# Altium schematic sheet Steering Wheel.SchDoc (part 2 of 2)
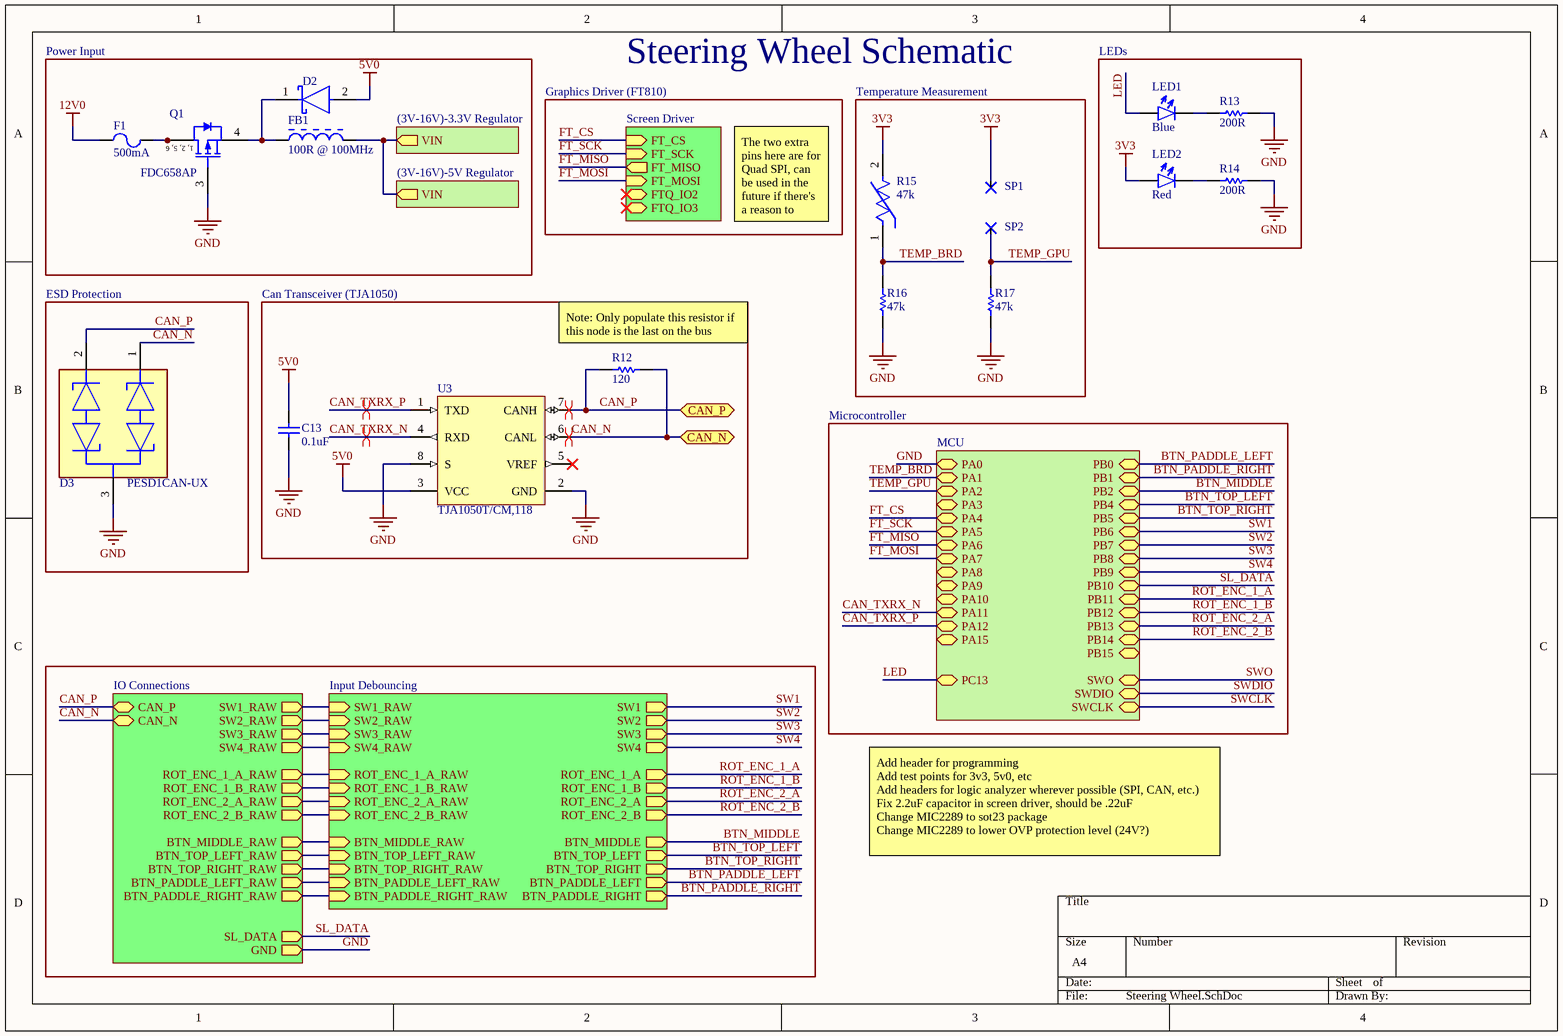
[diagram p1: Steering Wheel.SchDoc]

## Library data of the parts
C13 = CMP-2007-00279-1: Part Number: C0805C104K5RACTU; Manufacturer: Kemet; Dielectric Material: Ceramic; Capacitance: 100nF; Tolerance: 10%; Voltage Rating: 50V; Dielectric: X7R; Voltage: 500V; Supplier 1: LCSC; Supplier Part Number 1: C129690; Manufacturer Part Number: C0805C104K5RACTU; RoHS: Yes; Category: Ceramic Capacitors; Stock 1: 744050; Pricing 1: 50=0.02360, 500=0.01780, 1500=0.01680, 5000=0.01570, 25000=0.01530, 50000=0.01500, 50=0.02250, 500=0.01700, 1500=0.01600, 5000=0.01500, 25000=0.01460, 50000=0.01430, 50=0.11760, 500=0.08890, 1500=0.08370, 5000=0.07840, 25000=0.07610, 50000=0.07490, 50=0.10700, 500=0.08090, 1500=0.07610, 5000=0.07130, 25000=0.06920, 50000=0.06810, 50=0.01440, 500=0.01090, 1500=0.01020, 5000=0.00960, 25000=0.00930, 50000=0.00920, 50=0.01310, 500=0.00990, 1500=0.00930, 5000=0.00870, 25000=0.00850, 50000=0.00830, 50=0.13020, 500=0.09850, 1500=0.09270, 5000=0.08680, 25000=0.08420, 50000=0.08300, 50=1.77600, 500=1.34310, 1500=1.26360, 5000=1.18400, 25000=1.14870, 50000=1.13130, 50=0.07150, 500=0.05410, 1500=0.05090, 5000=0.04770, 25000=0.04620, 50000=0.04550, 50=1.20420, 500=0.91060, 1500=0.85670, 5000=0.80280, 25000=0.77880, 50000=0.76700, 50=0.14790, 500=0.11180, 1500=0.10520, 5000=0.09860, 25000=0.09570, 50000=0.09420, 50=0.02320, 500=0.01750, 1500=0.01650, 5000=0.01550, 25000=0.01500, 50000=0.01480, 50=0.01680, 500=0.01271, 1500=0.01196, 5000=0.01120, 25000=0.01087, 50000=0.01070 (AUD); Mount: Surface Mount,PCB; Case/Package: 0805; Number of Pins: 2; Case Code (Imperial): 0805; Case Code (Metric): 2012; Contact Plating: Tin,Matte; Min Operating Temperature: -55°C; Max Operating Temperature: 125°C; Packaging: Tape and Reel; Termination: SMD/SMT; Package Quantity: 4000; Voltage Rating (DC): 50V; Length: 2mm; Height: 0.9mm; Depth: 1.25mm; Width: 1.2mm; Thickness: 0.035inch; Lead Pitch: 0.75mm; Radiation Hardening: No; REACH SVHC: No SVHC; ComponentLink1URL: https://datasheet.ciiva.com/14589/70095383-14589048.pdf?src-supplier=Allied+Electronics; ComponentLink1Description: https://datasheet.ciiva.com/14589/70095383-14589048.pdf?src-supplier=Allied+Electronics; ComponentLink2URL: https://datasheet.ciiva.com/28682/1851736-28682232.pdf?src-supplier=Element14; ComponentLink2Description: https://datasheet.ciiva.com/28682/1851736-28682232.pdf?src-supplier=Element14; ComponentLink3URL: https://datasheet.ciiva.com/32431/slceramic-chip-condensers-e-32431755.pdf?src-supplier=Distrelec; ComponentLink3Description: https://datasheet.ciiva.com/32431/slceramic-chip-condensers-e-32431755.pdf?src-supplier=Distrelec; ComponentLink4URL: https://datasheet.ciiva.com/18410/70095383-18410815.pdf?src-supplier=Allied+Electronics; ComponentLink4Description: https://datasheet.ciiva.com/18410/70095383-18410815.pdf?src-supplier=Allied+Electronics; Supplier 2: Digi-Key; Supplier Part Number 2: 399-1170-1-ND; Stock 2: 2736847; Pricing 2: 1=0.16000, 10=0.11500, 50=0.06540, 100=0.05420, 500=0.03802, 1000=0.03147 (USD)
D2 = CMP-02539-000022-1: DIODE SCHOTTKY 40V 3A DO214AC; Manufacturer Part Number: SSA34-E3/61T; Manufacturer: Vishay; Standoff Height: 0mm; Peak Reverse Current: 0.2mA; Max Surge Forward Current: 75A; Max Junction Temp: +150°C; Forward Voltage: 490mV; Element Configuration: Single; Max Reverse Current: 200uA; Polarity: Standard; Mouser Description: Schottky Diodes & Rectifiers 3.0 Amp 40 Volt; Package: 95400; Octopart: https://octopart.com/ssa34-e3%2F61t-vishay-39552934; Reverse Voltage: 40V; Height: 2.29mm; Max Repetitive Reverse Voltage: 40V; Device Class L2: Diodes; Forward Current: 3A; Device Class L1: Discrete Semiconductors; Temperature Range High: +150°C; Automotive: No; ComponentLink2URL: http://www.vishay.com/docs/88883/ssa33l.pdf; Footprint Url: https://www.vishay.com/docs/95400/sma.pdf; ComponentLink2Description: Datasheet; RoHS: TRUE; Temperature Range Low: -65°C; Temperature: -65°C to +150°C; Device Class L3: Schottky Diodes; Lead Free: Yes; Digikey Description: DIODE SCHOTTKY 40V 3A DO214AC; Category: Diode; Supplier 1: LCSC; Supplier Part Number 1: C466998; Stock 1: 1522; Pricing 1: 1=0.19720, 10=0.14690, 30=0.13770, 100=0.12850, 500=0.12440, 1000=0.12230, 1=0.18560, 10=0.13830, 30=0.12950, 100=0.12090, 500=0.11700, 1000=0.11510, 1=0.94580, 10=0.70470, 30=0.66030, 100=0.61610, 500=0.59640, 1000=0.58660, 1=0.88710, 10=0.66100, 30=0.61940, 100=0.57790, 500=0.55940, 1000=0.55020, 1=0.11920, 10=0.08880, 30=0.08320, 100=0.07760, 500=0.07510, 1000=0.07390, 1=0.10870, 10=0.08100, 30=0.07590, 100=0.07080, 500=0.06860, 1000=0.06750, 1=1.07410, 10=0.80030, 30=0.74990, 100=0.69970, 500=0.67730, 1000=0.66620, 1=14.63490, 10=10.90410, 30=10.21770, 100=9.53310, 500=9.22870, 1000=9.07730, 1=0.57820, 10=0.43080, 30=0.40370, 100=0.37660, 500=0.36460, 1000=0.35860, 1=10.83120, 10=8.07000, 30=7.56210, 100=7.05530, 500=6.83010, 1000=6.71810, 1=1.26610, 10=0.94330, 30=0.88390, 100=0.82470, 500=0.79840, 1000=0.78530, 1=0.19100, 10=0.14230, 30=0.13340, 100=0.12440, 500=0.12050, 1000=0.11850, 1=0.13860, 10=0.10327, 30=0.09677, 100=0.09028, 500=0.08740, 1000=0.08597 (AUD); Mount: Surface Mount; Case/Package: SMA; Number of Pins: 2; Contact Plating: Tin,Matte; Min Operating Temperature: -65°C; Max Operating Temperature: 150°C; Packaging: Tape and Reel; Average Rectified Current: 3A; Max Repetitive Reverse Voltage (Vrrm): 40V; Max Reverse Voltage (DC): 40V; Package Quantity: 1; Max Forward Surge Current (Ifsm): 75A; Peak Non-Repetitive Surge Current: 75A; Max Surge Current: 75A; Max Reverse Leakage Current: 200uA; Voltage Rating (DC): 40V; Current Rating: 3A; Output Current: 3A; Length: 4.5mm; Width: 2.79mm; Radiation Hardening: No; REACH SVHC: Unknown; ComponentLink1URL: https://datasheet.ciiva.com/26912/getdatasheetpartid-73599-26912721.pdf?src-supplier=Verical; ComponentLink1Description: https://datasheet.ciiva.com/26912/getdatasheetpartid-73599-26912721.pdf?src-supplier=Verical; ComponentLink3URL: https://datasheet.ciiva.com/23793/1761274-23793348.pdf?src-supplier=Newark; ComponentLink3Description: https://datasheet.ciiva.com/23793/1761274-23793348.pdf?src-supplier=Newark; ComponentLink4URL: https://datasheet.ciiva.com/18434/70217332-18434231.pdf?src-supplier=Allied+Electronics; ComponentLink4Description: https://datasheet.ciiva.com/18434/70217332-18434231.pdf?src-supplier=Allied+Electronics; ComponentLink5URL: https://datasheet.ciiva.com/26295/1697108-26295418.pdf?src-supplier=Element14; ComponentLink5Description: https://datasheet.ciiva.com/26295/1697108-26295418.pdf?src-supplier=Element14; ComponentLink6URL: https://datasheet.ciiva.com/16456/ssa33l-16456157.pdf?src-supplier=Future+Electronics; ComponentLink6Description: https://datasheet.ciiva.com/16456/ssa33l-16456157.pdf?src-supplier=Future+Electronics; Supplier 2: Digi-Key; Supplier Part Number 2: SSA34-E3/61TGICT-ND; Stock 2: 18229; Pricing 2: 1=0.51000, 10=0.37800, 100=0.26400, 500=0.16720 (USD)
D3 = CMP-14436-000006-1: TVS DIODE 24V 50V SC70-3; Manufacturer: Nexperia; Supplier Part Number 1: C152727; Supplier 1: LCSC; Supplier 2: Digi-Key; Supplier Part Number 2: 1727-1306-1-ND; Manufacturer Part Number: PESD1CAN-UX; RoHS: No; Category: ESD and Circuit Protection ICs; Stock 2: 174859; Pricing 2: 1=0.38000, 10=0.25600, 100=0.15110, 500=0.10230, 1000=0.08138 (USD); ComponentLink1URL: https://www.mouser.com/ds/2/302/PESD1CAN-U-1151714.pdf?src-supplier=Mouser; ComponentLink1Description: https://www.mouser.com/ds/2/302/PESD1CAN-U-1151714.pdf?src-supplier=Mouser; ComponentLink2URL: http://www.farnell.com/datasheets/1738911.pdf?src-supplier=Farnell; ComponentLink2Description: http://www.farnell.com/datasheets/1738911.pdf?src-supplier=Farnell; ComponentLink3URL: http://www.farnell.com/datasheets/1738911.pdf?src-supplier=Newark; ComponentLink3Description: http://www.farnell.com/datasheets/1738911.pdf?src-supplier=Newark; ComponentLink4URL: https://assets.nexperia.com/documents/data-sheet/PESD1CAN-U.pdf?src-supplier=Digi-Key; ComponentLink4Description: https://assets.nexperia.com/documents/data-sheet/PESD1CAN-U.pdf?src-supplier=Digi-Key; ComponentLink5URL: http://www.farnell.com/datasheets/1738911.pdf?src-supplier=Element14; ComponentLink5Description: http://www.farnell.com/datasheets/1738911.pdf?src-supplier=Element14
F1 = CMP-2000-05698-1: NANO2(R) Slo-Blo(R) Fuse, 0.5 A, 125 V, -55 to 125 degC, 2-Pin SMD, RoHS, Tape and Reel; Manufacturer: Littelfuse; Manufacturer Part Number: 0452.500MRL; Current Rating: 0.5A; Working Voltage-Max: 125V; Body Material: Ceramic; Fuse Type: Board Mount (Cartridge Style Excluded); DC Cold Resistance: 700mR; Approvals: CSA,UR,UL; Manufacturer URL: http://www.littelfuse.com/; Operating Temp Range: -55to+125°C; Package Reference: 0452; Mounting Technology: SurfaceMount; Datasheet Version: 07/2015; Response Characteristic: Slo-Blo; Datasheet URL: http://download.siliconexpert.com/pdfs/2015/7/2/10/39/10/885/ltf_/manual/4322647674859060843226474844920160littelfuse_fuse_452_454_datasheet.pdf.pdf.pdf; Size: 6.10x2.69mm; Package Description: 2-Pin Surface Mount Device, Body 6.1 x 2.69 mm; Supplier 1: LCSC; Supplier Part Number 1: C151120; RoHS: Yes; Category: Fuses; Stock 1: 2796; Pricing 1: 1=0.31300, 10=0.23510, 30=0.22080, 100=0.20640, 500=0.20010, 1000=0.19690, 1=0.29850, 10=0.22420, 30=0.21050, 100=0.19690, 500=0.19080, 1000=0.18780, 1=1.52260, 10=1.14360, 30=1.07400, 100=1.00440, 500=0.97340, 1000=0.95810, 1=1.42430, 10=1.06970, 30=1.00460, 100=0.93950, 500=0.91050, 1000=0.89620, 1=0.19140, 10=0.14370, 30=0.13500, 100=0.12620, 500=0.12230, 1000=0.12040, 1=0.17340, 10=0.13020, 30=0.12230, 100=0.11440, 500=0.11080, 1000=0.10910, 1=1.73770, 10=1.30510, 30=1.22570, 100=1.14620, 500=1.11080, 1000=1.09340, 1=23.61790, 10=17.73840, 30=16.65870, 100=15.57910, 500=15.09800, 1000=14.86100, 1=0.93380, 10=0.70130, 30=0.65860, 100=0.61590, 500=0.59690, 1000=0.58750, 1=17.53210, 10=13.16760, 30=12.36620, 100=11.56470, 500=11.20760, 1000=11.03160, 1=2.00280, 10=1.50420, 30=1.41260, 100=1.32110, 500=1.28030, 1000=1.26020, 1=0.30580, 10=0.22970, 30=0.21570, 100=0.20170, 500=0.19550, 1000=0.19240, 1=0.22422, 10=0.16840, 30=0.15815, 100=0.14790, 500=0.14333, 1000=0.14108 (AUD); Mount: Surface Mount; Case/Package: SMD/SMT; Number of Pins: 2; Terminal Material: Gold; Housing Material: Ceramic; Contact Plating: Gold; Min Operating Temperature: -55°C; Max Operating Temperature: 125°C; Packaging: Tape and Reel; Voltage Rating: 125V; Package Quantity: 1000; Voltage Rating (DC): 125V; Fuse Current: 500mA; Voltage Rating (AC): 125V; Termination: SMD/SMT; Resistance: 700mR; Working Voltage: 125V; Diameter: 2.69mm; Length: 6.1mm; Height: 2.69mm; Width: 2.69mm; Depth: 2.69mm; Radiation Hardening: No; REACH SVHC: No SVHC; Lead Free: Lead Free; ComponentLink1URL: https://datasheet.ciiva.com/299/littelfuse-fuse-452-454-series-299910.pdf?src-supplier=Digi-Key; ComponentLink1Description: https://datasheet.ciiva.com/299/littelfuse-fuse-452-454-series-299910.pdf?src-supplier=Digi-Key; ComponentLink2URL: https://datasheet.ciiva.com/15187/getdatasheetpartid-110524-15187078.pdf?src-supplier=Verical; ComponentLink2Description: https://datasheet.ciiva.com/15187/getdatasheetpartid-110524-15187078.pdf?src-supplier=Verical; ComponentLink3URL: https://datasheet.ciiva.com/299/littelfuse-fuse-452-454-series-299911.pdf?src-supplier=Digi-Key; ComponentLink3Description: https://datasheet.ciiva.com/299/littelfuse-fuse-452-454-series-299911.pdf?src-supplier=Digi-Key; ComponentLink4URL: https://datasheet.ciiva.com/299/littelfuse-fuse-452-454-series-299912.pdf?src-supplier=Digi-Key; ComponentLink4Description: https://datasheet.ciiva.com/299/littelfuse-fuse-452-454-series-299912.pdf?src-supplier=Digi-Key; ComponentLink5URL: https://datasheet.ciiva.com/46406/1788342-46406140.pdf?src-supplier=Element14; ComponentLink5Description: https://datasheet.ciiva.com/46406/1788342-46406140.pdf?src-supplier=Element14; Supplier 2: Digi-Key; Supplier Part Number 2: F2598CT-ND; Stock 2: 8127; Pricing 2: 1=1.59000, 5=1.51600, 10=1.44100, 50=1.16280, 100=0.98590, 250=0.96064, 500=0.80896 (USD)
FB1 = CMP-0686-00557-6: Chip Ferrite Bead for Power Lines, 120 Ohm, 2000 mA, -55 to 125 degC, 1.6 x 0.8 x 0.95 mm SMD, Tape and Reel; PartNumber: BLM18PG121SN1D; Manufacturer: Murata; Impedance (at 100 MHz): 120 Ohm +/- 25%; Rated Current: 2000 mA; DC Resistance: 0.05 Ohm Max.; Material: Steel,Ferrite; Impedance: 120R; Current Rating: 2A; DC Resistance (DCR): 50mR; Number of Lines: 1; Tolerance: 25%; Shielding: Unshielded; DatasheetVersion: 08/2013; PackageDescription: 2-Pin Chip, Body 1.6 x 0.8 mm; ComponentLink3URL: http://www.murata.com/products/catalog/pdf/c31e.pdf; ComponentLink1URL: http://www.murata.com/; ComponentLink2Description: Datasheet; Mounting Technology: Surface Mount; ComponentLink1Description: Manufacturer URL; PackageReference: BLM18_H950-2; ComponentLink2URL: http://www.murata.com/products/catalog/pdf/c31e.pdf; ComponentLink3Description: Package Specification; Packing: Tape and Reel; Operating Temperature Range: -55 to 125 degC; Supplier 1: LCSC; Supplier Part Number 1: C14709; Manufacturer Part Number: BLM18PG121SN1D; RoHS: Yes; Category: Inductors; Stock 1: 101650; Pricing 1: 50=0.01390, 500=0.01020, 1500=0.00950, 5000=0.00880, 25000=0.00850, 50000=0.00840, 50=0.01320, 500=0.00970, 1500=0.00910, 5000=0.00840, 25000=0.00810, 50000=0.00800, 50=0.06740, 500=0.04940, 1500=0.04610, 5000=0.04280, 25000=0.04130, 50000=0.04060, 50=0.06270, 500=0.04600, 1500=0.04290, 5000=0.03980, 25000=0.03850, 50000=0.03780, 50=0.00840, 500=0.00620, 1500=0.00580, 5000=0.00540, 25000=0.00520, 50000=0.00510, 50=0.00770, 500=0.00560, 1500=0.00530, 5000=0.00490, 25000=0.00470, 50000=0.00460, 50=0.07670, 500=0.05620, 1500=0.05250, 5000=0.04870, 25000=0.04700, 50000=0.04620, 50=1.04540, 500=0.76650, 1500=0.71530, 5000=0.66410, 25000=0.64130, 50000=0.63000, 50=0.04110, 500=0.03010, 1500=0.02810, 5000=0.02610, 25000=0.02520, 50000=0.02480, 50=0.78020, 500=0.57200, 1500=0.53390, 5000=0.49560, 25000=0.47870, 50000=0.47020, 50=0.08860, 500=0.06500, 1500=0.06070, 5000=0.05630, 25000=0.05440, 50000=0.05340, 50=0.01350, 500=0.00990, 1500=0.00930, 5000=0.00860, 25000=0.00830, 50000=0.00820, 50=0.00989, 500=0.00725, 1500=0.00677, 5000=0.00628, 25000=0.00607, 50000=0.00596 (AUD); Case/Package: 0603; Number of Pins: 2; Case Code (Metric): 1608; Case Code (Imperial): 0603; Core Material: Ferrite; Min Operating Temperature: -55°C; Max Operating Temperature: 125°C; Package Quantity: 1; Packaging: Tape and Reel; Max DC Current: 2A; Termination: SMD/SMT; Test Frequency: 100MHz; Frequency: 100MHz; Max Current Rating: 2A; DC Current: 2A; Number of Circuits: 1; Length: 1.6mm; Height: 0.8mm; Width: 0.8mm; Depth: 0.8mm; Radiation Hardening: No; REACH SVHC: No SVHC; Lead Free: Lead Free; ComponentLink4URL: https://datasheet.ciiva.com/5709/1740433-5709171.pdf?src-supplier=Farnell; ComponentLink4Description: https://datasheet.ciiva.com/5709/1740433-5709171.pdf?src-supplier=Farnell; ComponentLink5URL: https://datasheet.ciiva.com/11799/0900766b81275ca5-11799546.pdf?src-supplier=RSComponents; ComponentLink5Description: https://datasheet.ciiva.com/11799/0900766b81275ca5-11799546.pdf?src-supplier=RSComponents; ComponentLink6URL: https://datasheet.ciiva.com/19454/1845013-19454715.pdf?src-supplier=Jameco; ComponentLink6Description: https://datasheet.ciiva.com/19454/1845013-19454715.pdf?src-supplier=Jameco; ComponentLink7URL: https://datasheet.ciiva.com/3854/5emiapbde-1-3854039.pdf?src-supplier=Arrow+Electronics; ComponentLink7Description: https://datasheet.ciiva.com/3854/5emiapbde-1-3854039.pdf?src-supplier=Arrow+Electronics; ComponentLink8URL: https://datasheet.ciiva.com/29347/442365-da-01-en-chip-drossel-0603-120r-2000ma-1-6x0-8mm-29347911.pdf?src-supplier=Conrad; ComponentLink8Description: https://datasheet.ciiva.com/29347/442365-da-01-en-chip-drossel-0603-120r-2000ma-1-6x0-8mm-29347911.pdf?src-supplier=Conrad; ComponentLink9URL: https://datasheet.ciiva.com/3081/l0110s0100blm18p-3081632.pdf?src-supplier=Avnet; ComponentLink9Description: https://datasheet.ciiva.com/3081/l0110s0100blm18p-3081632.pdf?src-supplier=Avnet; ComponentLink10URL: https://datasheet.ciiva.com/8021/1740433-8021493.pdf?src-supplier=Element14; ComponentLink10Description: https://datasheet.ciiva.com/8021/1740433-8021493.pdf?src-supplier=Element14; ComponentLink11URL: https://datasheet.ciiva.com/6212/l0110s0100blm18p-6212502.pdf?src-supplier=Digi-Key; ComponentLink11Description: https://datasheet.ciiva.com/6212/l0110s0100blm18p-6212502.pdf?src-supplier=Digi-Key; ComponentLink12URL: https://datasheet.ciiva.com/8021/1740433-8021494.pdf?src-supplier=Element14; ComponentLink12Description: https://datasheet.ciiva.com/8021/1740433-8021494.pdf?src-supplier=Element14; ComponentLink13URL: https://datasheet.ciiva.com/6212/l0110s0100blm18p-6212504.pdf?src-supplier=Digi-Key; ComponentLink13Description: https://datasheet.ciiva.com/6212/l0110s0100blm18p-6212504.pdf?src-supplier=Digi-Key; ComponentLink14URL: https://datasheet.ciiva.com/14122/blm-series-eng-tds-14122905.pdf?src-supplier=Distrelec; ComponentLink14Description: https://datasheet.ciiva.com/14122/blm-series-eng-tds-14122905.pdf?src-supplier=Distrelec; ComponentLink15URL: https://datasheet.ciiva.com/25903/l0110s0100blm18p-25903483.pdf?src-supplier=Avnet+Europe; ComponentLink15Description: https://datasheet.ciiva.com/25903/l0110s0100blm18p-25903483.pdf?src-supplier=Avnet+Europe; ComponentLink16URL: https://datasheet.ciiva.com/41449/001172297-da-01-en-drossel-0603-120r-1-6x0-8mm-4000st-41449659.pdf?src-supplier=Conrad; ComponentLink16Description: https://datasheet.ciiva.com/41449/001172297-da-01-en-drossel-0603-120r-1-6x0-8mm-4000st-41449659.pdf?src-supplier=Conrad; Supplier 2: Digi-Key; Supplier Part Number 2: 490-1037-1-ND; Stock 2: 652829; Pricing 2: 1=0.10000, 10=0.07600, 25=0.06920, 50=0.06220, 100=0.04550, 250=0.03312, 500=0.03036, 1000=0.02622 (USD)
LED1 = LED: Forward Voltage: 2.7; Current: 20mA; Color: Blue; Supplier 1: LCSC; Supplier Part Number 1: C84259
LED2 = LED: Forward Voltage: 2.4; Current: 25; Color: Red; Supplier 1: LCSC; Supplier Part Number 1: C72037
Q1 = CMP-2000-06244-1: Single P-Channel Logic Level PowerTrench(R) MOSFET, -30 V, -4 A, -55 to 150 degC, 6-Pin SOT23, RoHS, Tape and Reel; Manufacturer: Fairchild Semiconductor; Drain-to-Source Voltage [Vdss]: 30V; Qg Gate Charge: 8.1nC; Rated Power Dissipation: 0.8W; Package Version: Rev. 5, 05/2015; Drain-Source On Resistance-Max: 50mO; Rise Time: 12ns; Number of Elements: 1; Max Power Dissipation: 1.6W; Rds On Max: 50mR; Continuous Drain Current (ID): 4A; Drain to Source Resistance: 44mR; Turn-Off Delay Time: 16ns; Drain to Source Breakdown Voltage: -30V; Gate to Source Voltage (Vgs): 25V; Input Capacitance: 470pF; Threshold Voltage: -1.8V; Turn-On Delay Time: 7ns; Datasheet Version: Rev. B1, 11/2011; Channel Type: P-Channel; Package URL: https://www.fairchildsemi.com/package-drawings/MA/MA06A.pdf; Datasheet URL: https://datasheet.ciiva.com/15137/getdatasheetpartid-92299-15137737.pdf; Package Description: 6-Pin Small Outline Transistor, Body 2.9 x 1.6 mm, Pitch 0.95 mm; Mounting Technology: SurfaceMount; Manufacturer URL: https://www.fairchildsemi.com/; Package Reference: SOT23-6; Supplier 1: LCSC; Supplier Part Number 1: C412512; Manufacturer Part Number: FDC658AP; RoHS: Yes; Category: MOSFETs; Stock 1: 69; Pricing 1: 1=0.28960, 10=0.21890, 30=0.20590, 100=0.19290, 500=0.18720, 1000=0.18430, 1=0.27850, 10=0.21050, 30=0.19800, 100=0.18550, 500=0.18000, 1000=0.17730, 1=1.43630, 10=1.08570, 30=1.02130, 100=0.95690, 500=0.92830, 1000=0.91410, 1=1.32530, 10=1.00170, 30=0.94230, 100=0.88290, 500=0.85650, 1000=0.84340, 1=0.17810, 10=0.13460, 30=0.12670, 100=0.11870, 500=0.11510, 1000=0.11340, 1=0.16490, 10=0.12460, 30=0.11720, 100=0.10980, 500=0.10650, 1000=0.10490, 1=1.63950, 10=1.23920, 30=1.16570, 100=1.09220, 500=1.05960, 1000=1.04340, 1=22.35360, 10=16.89600, 30=15.89400, 100=14.89180, 500=14.44630, 1000=14.22610, 1=0.87570, 10=0.66190, 30=0.62270, 100=0.58340, 500=0.56590, 1000=0.55730, 1=15.91350, 10=12.02820, 30=11.31490, 100=10.60150, 500=10.28430, 1000=10.12760, 1=1.85520, 10=1.40230, 30=1.31910, 100=1.23590, 500=1.19890, 1000=1.18070, 1=0.28820, 10=0.21790, 30=0.20490, 100=0.19200, 500=0.18630, 1000=0.18340, 1=0.21155, 10=0.15990, 30=0.15042, 100=0.14093, 500=0.13672, 1000=0.13463 (AUD); Mount: Surface Mount; Case/Package: SOT-23-6; Number of Pins: 6; Weight: 0.036g; Contact Plating: Tin,Matte; Min Operating Temperature: -55°C; Max Operating Temperature: 150°C; Packaging: Tape and Reel; Package Quantity: 3000; Power Dissipation: 1.6W; Drain to Source Voltage (Vdss): 30V; Element Configuration: Single; Fall Time: 12ns; On-State Resistance: 50MR; Nominal Vgs: -1.8V; Dual Supply Voltage: -30V; Termination: SMD/SMT; Length: 3mm; Height: 1mm; Width: 1.7mm; Radiation Hardening: No; REACH SVHC: No SVHC; Lead Free: Lead Free; ComponentLink1URL: https://datasheet.ciiva.com/27056/2021964-27056274.pdf?src-supplier=Jameco; ComponentLink1Description: https://datasheet.ciiva.com/27056/2021964-27056274.pdf?src-supplier=Jameco; ComponentLink2URL: https://datasheet.ciiva.com/15137/getdatasheetpartid-92299-15137737.pdf?src-supplier=Verical; ComponentLink2Description: https://datasheet.ciiva.com/15137/getdatasheetpartid-92299-15137737.pdf?src-supplier=Verical; ComponentLink3URL: https://datasheet.ciiva.com/4438/fdc658ap-103298-4438971.pdf?src-supplier=Mouser; ComponentLink3Description: https://datasheet.ciiva.com/4438/fdc658ap-103298-4438971.pdf?src-supplier=Mouser; ComponentLink4URL: https://datasheet.ciiva.com/28659/1639784-28659062.pdf?src-supplier=Element14; ComponentLink4Description: https://datasheet.ciiva.com/28659/1639784-28659062.pdf?src-supplier=Element14; ComponentLink5URL: https://datasheet.ciiva.com/932/fdc658ap-932028.pdf?src-supplier=Digi-Key; ComponentLink5Description: https://datasheet.ciiva.com/932/fdc658ap-932028.pdf?src-supplier=Digi-Key; ComponentLink6URL: https://datasheet.ciiva.com/932/fdc658ap-932029.pdf?src-supplier=Digi-Key; ComponentLink6Description: https://datasheet.ciiva.com/932/fdc658ap-932029.pdf?src-supplier=Digi-Key; ComponentLink7URL: https://datasheet.ciiva.com/7967/1639784-7967853.pdf?src-supplier=Element14; ComponentLink7Description: https://datasheet.ciiva.com/7967/1639784-7967853.pdf?src-supplier=Element14; ComponentLink8URL: https://datasheet.ciiva.com/22700/1639784-22700877.pdf?src-supplier=Element14; ComponentLink8Description: https://datasheet.ciiva.com/22700/1639784-22700877.pdf?src-supplier=Element14; ComponentLink9URL: https://datasheet.ciiva.com/932/fdc658ap-932030.pdf?src-supplier=Digi-Key; ComponentLink9Description: https://datasheet.ciiva.com/932/fdc658ap-932030.pdf?src-supplier=Digi-Key; Supplier 2: Digi-Key; Supplier Part Number 2: FDC658APCT-ND; Stock 2: 24038; Pricing 2: 1=0.52000, 10=0.42000, 25=0.38440, 100=0.24140, 500=0.22350, 1000=0.15198 (USD)
R12 = CMP-1665-00010-4: Chip Resistor, 120 Ohm, +/- 1%, 0.125 W, -55 to 155 degC, 0805 (2012 Metric), RoHS, Tape and Reel; Manufacturer: Panasonic; Manufacturer Part Number: ERJ-6ENF1200V; Voltage Rating: 150 V; Resistance: 120R; Temperature Coefficient: 100ppm/°C; Power Rating: 125mW; Voltage Rating (DC): 150V; Mount: Surface Mount; ComponentLink1Description: Manufacturer URL; ComponentLink1URL: http://www.panasonic.com/; RoHSCompliant: true; Min Operating Temperature: -55 degC; Length: 2 mm; Max Operating Temperature: 155 degC; Packaging: Tape and Reel; Package Quantity: 5000; REACH SVHC: Yes; Pins: 2; ComponentLink2Description: Datasheet; DatasheetVersion: 04/2015; PackageReference: 0805; ComponentLink2URL: http://industrial.panasonic.com/cdbs/www-data/pdf/RDA0000/AOA0000C86.pdf; Mounting Technology: Surface Mount; PackageDescription: 2-Pin Surface Mount Device, Body 2 x 1.25 mm; Height: 0.6 mm; Supplier 1: LCSC; Supplier Part Number 1: C409952; RoHS: Yes; Category: Chip SMD Resistors; Stock 1: 13050; Pricing 1: 50=0.01500, 500=0.01100, 1500=0.01030, 5000=0.00950, 25000=0.00920, 50000=0.00910, 50=0.01430, 500=0.01050, 1500=0.00980, 5000=0.00910, 25000=0.00880, 50000=0.00860, 50=0.07490, 500=0.05490, 1500=0.05130, 5000=0.04760, 25000=0.04600, 50000=0.04520, 50=0.06810, 500=0.04990, 1500=0.04660, 5000=0.04330, 25000=0.04180, 50000=0.04110, 50=0.00910, 500=0.00670, 1500=0.00630, 5000=0.00580, 25000=0.00560, 50000=0.00550, 50=0.00830, 500=0.00610, 1500=0.00570, 5000=0.00530, 25000=0.00510, 50000=0.00500, 50=0.08290, 500=0.06080, 1500=0.05680, 5000=0.05270, 25000=0.05090, 50000=0.05000, 50=1.13040, 500=0.82940, 1500=0.77410, 5000=0.71880, 25000=0.69430, 50000=0.68220, 50=0.04550, 500=0.03340, 1500=0.03120, 5000=0.02890, 25000=0.02800, 50000=0.02750, 50=0.76640, 500=0.56230, 1500=0.52490, 5000=0.48740, 25000=0.47080, 50000=0.46250, 50=0.09410, 500=0.06910, 1500=0.06450, 5000=0.05990, 25000=0.05780, 50000=0.05680, 50=0.01480, 500=0.01080, 1500=0.01010, 5000=0.00940, 25000=0.00910, 50000=0.00890, 50=0.01070, 500=0.00785, 1500=0.00732, 5000=0.00680, 25000=0.00657, 50000=0.00645 (AUD); Case/Package: 0805; Number of Pins: 2; Case Code (Imperial): 0805; Case Code (Metric): 2012; Contact Plating: Tin; Tolerance: 1%; Composition: Thick Film; Termination: SMD/SMT; Number of Terminations: 2; Military Standard: Not; Max Power Dissipation: 125mW; Features: Automotive AEC-Q200; Width: 1.2mm; Depth: 1.25mm; Radiation Hardening: No; Lead Free: Lead Free; ComponentLink3URL: https://datasheet.ciiva.com/11821/0900766b80f80784-11821533.pdf?src-supplier=RSComponents; ComponentLink3Description: https://datasheet.ciiva.com/11821/0900766b80f80784-11821533.pdf?src-supplier=RSComponents; ComponentLink4URL: https://datasheet.ciiva.com/22673/1678782-22673701.pdf?src-supplier=Element14; ComponentLink4Description: https://datasheet.ciiva.com/22673/1678782-22673701.pdf?src-supplier=Element14; ComponentLink5URL: https://datasheet.ciiva.com/15158/getdatasheetpartid-248620-15158999.pdf?src-supplier=Verical; ComponentLink5Description: https://datasheet.ciiva.com/15158/getdatasheetpartid-248620-15158999.pdf?src-supplier=Verical; ComponentLink6URL: https://datasheet.ciiva.com/16782/70260748-16782215.pdf?src-supplier=Allied+Electronics; ComponentLink6Description: https://datasheet.ciiva.com/16782/70260748-16782215.pdf?src-supplier=Allied+Electronics; ComponentLink7URL: https://datasheet.ciiva.com/24069/aoa0000ce2-24069192.pdf?src-supplier=Mouser; ComponentLink7Description: https://datasheet.ciiva.com/24069/aoa0000ce2-24069192.pdf?src-supplier=Mouser; ComponentLink8URL: https://datasheet.ciiva.com/46373/1678782-46373272.pdf?src-supplier=Element14; ComponentLink8Description: https://datasheet.ciiva.com/46373/1678782-46373272.pdf?src-supplier=Element14; ComponentLink9URL: https://datasheet.ciiva.com/46373/1678782-46373273.pdf?src-supplier=Element14; ComponentLink9Description: https://datasheet.ciiva.com/46373/1678782-46373273.pdf?src-supplier=Element14; ComponentLink10URL: https://datasheet.ciiva.com/17207/aoa0000ce2-17207722.pdf?src-supplier=Avnet+Europe; ComponentLink10Description: https://datasheet.ciiva.com/17207/aoa0000ce2-17207722.pdf?src-supplier=Avnet+Europe; ComponentLink11URL: https://datasheet.ciiva.com/6082/426256-6082139.pdf?src-supplier=Farnell; ComponentLink11Description: https://datasheet.ciiva.com/6082/426256-6082139.pdf?src-supplier=Farnell; ComponentLink12URL: https://datasheet.ciiva.com/22687/1678782-22687419.pdf?src-supplier=Element14; ComponentLink12Description: https://datasheet.ciiva.com/22687/1678782-22687419.pdf?src-supplier=Element14; ComponentLink13URL: https://datasheet.ciiva.com/7886/426256-7886749.pdf?src-supplier=Element14; ComponentLink13Description: https://datasheet.ciiva.com/7886/426256-7886749.pdf?src-supplier=Element14; ComponentLink14URL: https://datasheet.ciiva.com/9117/aoa0000ce2-9117405.pdf?src-supplier=Avnet; ComponentLink14Description: https://datasheet.ciiva.com/9117/aoa0000ce2-9117405.pdf?src-supplier=Avnet; ComponentLink15URL: https://datasheet.ciiva.com/16765/70260748-16765246.pdf?src-supplier=Allied+Electronics; ComponentLink15Description: https://datasheet.ciiva.com/16765/70260748-16765246.pdf?src-supplier=Allied+Electronics; ComponentLink16URL: https://datasheet.ciiva.com/16514/aoa0000ce2-16514031.pdf?src-supplier=Avnet+Asia; ComponentLink16Description: https://datasheet.ciiva.com/16514/aoa0000ce2-16514031.pdf?src-supplier=Avnet+Asia; Supplier 2: Digi-Key; Supplier Part Number 2: P120CCT-ND; Stock 2: 93387; Pricing 2: 1=0.10000, 10=0.07200, 100=0.02750, 1000=0.01210, 2500=0.01045 (USD)
R13 R14 = Resistor: Resistor; Thick Film; Res 200 Ohms; Pwr-Rtg 0.125 W; Tol 1%; SMT; 0805; Cut Tape; Manufacturer: Panasonic; Manufacturer Part Number: ERJ-6ENF2000V; Temperature Coefficient: 100ppm/°C; Power Rating: 125mW; Voltage Rating: 150V; Value: 200R; Supplier 1: LCSC; Supplier Part Number 1: C413268; RoHS: Yes; Category: Chip SMD Resistors; Stock 1: 5800; Pricing 1: 50=0.01480, 500=0.01080, 1500=0.01010, 5000=0.00940, 25000=0.00900, 50000=0.00890, 50=0.01420, 500=0.01040, 1500=0.00970, 5000=0.00900, 25000=0.00860, 50000=0.00850, 50=0.07210, 500=0.05270, 1500=0.04910, 5000=0.04560, 25000=0.04400, 50000=0.04320, 50=0.06710, 500=0.04900, 1500=0.04570, 5000=0.04240, 25000=0.04090, 50000=0.04020, 50=0.00900, 500=0.00660, 1500=0.00610, 5000=0.00570, 25000=0.00550, 50000=0.00540, 50=0.00820, 500=0.00600, 1500=0.00560, 5000=0.00520, 25000=0.00500, 50000=0.00490, 50=0.08200, 500=0.05990, 1500=0.05590, 5000=0.05180, 25000=0.05000, 50000=0.04910, 50=1.11830, 500=0.81730, 1500=0.76200, 5000=0.70680, 25000=0.68220, 50000=0.67010, 50=0.04400, 500=0.03210, 1500=0.03000, 5000=0.02780, 25000=0.02680, 50000=0.02640, 50=0.83460, 500=0.61000, 1500=0.56870, 5000=0.52750, 25000=0.50920, 50000=0.50010, 50=0.09480, 500=0.06930, 1500=0.06460, 5000=0.05990, 25000=0.05790, 50000=0.05680, 50=0.01450, 500=0.01060, 1500=0.00990, 5000=0.00910, 25000=0.00880, 50000=0.00870, 50=0.01058, 500=0.00773, 1500=0.00721, 5000=0.00669, 25000=0.00646, 50000=0.00634 (AUD); Mount: Surface Mount; Case/Package: 0805; Weight: 0.000194oz; Case Code (Imperial): 0805; Case Code (Metric): 2012; Contact Plating: Tin; Min Operating Temperature: -55°C; Max Operating Temperature: 155°C; Resistance: 200R; Tolerance: 1%; Packaging: Tape and Reel; Termination: SMD/SMT; Resistor Type: Thick Film; Voltage Rating (DC): 150V; Package Quantity: 1; Number of Terminations: 2; Max Power Dissipation: 125mW; Features: Automotive AEC-Q200; Length: 2mm; Height: 0.6mm; Width: 1.2mm; Depth: 1.25mm; Radiation Hardening: No; Lead Free: Lead Free; REACH SVHC: No SVHC; Military Standard: Not; ComponentLink1URL: https://datasheet.ciiva.com/34303/1989113-34303623.pdf?src-supplier=Jameco; ComponentLink1Description: https://datasheet.ciiva.com/34303/1989113-34303623.pdf?src-supplier=Jameco; ComponentLink2URL: https://datasheet.ciiva.com/11821/0900766b80f80784-11821567.pdf?src-supplier=RSComponents; ComponentLink2Description: https://datasheet.ciiva.com/11821/0900766b80f80784-11821567.pdf?src-supplier=RSComponents; ComponentLink3URL: https://datasheet.ciiva.com/28691/1678782-28691975.pdf?src-supplier=Element14; ComponentLink3Description: https://datasheet.ciiva.com/28691/1678782-28691975.pdf?src-supplier=Element14; ComponentLink4URL: https://datasheet.ciiva.com/9117/aoa0000ce2-9117436.pdf?src-supplier=Avnet; ComponentLink4Description: https://datasheet.ciiva.com/9117/aoa0000ce2-9117436.pdf?src-supplier=Avnet; ComponentLink5URL: https://datasheet.ciiva.com/43460/426256-43460012.pdf?src-supplier=Farnell; ComponentLink5Description: https://datasheet.ciiva.com/43460/426256-43460012.pdf?src-supplier=Farnell; ComponentLink6URL: https://datasheet.ciiva.com/6137/426256-6137576.pdf?src-supplier=Farnell; ComponentLink6Description: https://datasheet.ciiva.com/6137/426256-6137576.pdf?src-supplier=Farnell; ComponentLink7URL: https://datasheet.ciiva.com/16778/70260748-16778890.pdf?src-supplier=Allied+Electronics; ComponentLink7Description: https://datasheet.ciiva.com/16778/70260748-16778890.pdf?src-supplier=Allied+Electronics; ComponentLink8URL: https://datasheet.ciiva.com/24158/aoa0000ce2-24158747.pdf?src-supplier=Mouser; ComponentLink8Description: https://datasheet.ciiva.com/24158/aoa0000ce2-24158747.pdf?src-supplier=Mouser; ComponentLink9URL: https://datasheet.ciiva.com/17207/aoa0000ce2-17207021.pdf?src-supplier=Avnet+Europe; ComponentLink9Description: https://datasheet.ciiva.com/17207/aoa0000ce2-17207021.pdf?src-supplier=Avnet+Europe; ComponentLink10URL: https://datasheet.ciiva.com/16775/70260748-16775615.pdf?src-supplier=Allied+Electronics; ComponentLink10Description: https://datasheet.ciiva.com/16775/70260748-16775615.pdf?src-supplier=Allied+Electronics; Supplier 2: Digi-Key; Supplier Part Number 2: P200CCT-ND; Stock 2: 357528; Pricing 2: 1=0.10000, 10=0.06500, 100=0.02500, 1000=0.01100, 2500=0.00950 (USD)
R15 = CMP-06022-000078-1: THERMISTOR NTC 47KOHM 4050K 0805; Manufacturer: Murata; Manufacturer Part Number: NCP21WB473J03RA; Current Rating: 200uA; Resistance: 47kR; Accuracy: 3%; Power Rating: 200mW; Tolerance: 5%; Length: 2mm; Packaging: Tape and Reel; Radiation Hardening: No; Lead Free: Lead Free; REACH SVHC: No SVHC; Width: 1.25mm; Depth: 1.25mm; Case Code (Imperial): 0805; Package Quantity: 1; Number of Pins: 2; Case/Package: 0805; Thickness: 150um; Case Code (Metric): 2012; Termination: SMD/SMT; Max Power Dissipation: 200mW; Min Operating Temperature: -40°C; Height: 0.85mm; Mount: Surface Mount; Max Operating Temperature: 125°C; Supplier 1: LCSC; Supplier Part Number 1: C113141; RoHS: Yes; Category: Thermistors; Stock 1: 5045; Pricing 1: 5=0.13730, 50=0.10270, 150=0.09630, 500=0.08980, 2500=0.08710, 5000=0.08570, 5=0.13480, 50=0.10080, 150=0.09450, 500=0.08820, 2500=0.08550, 5000=0.08410, 5=0.68550, 50=0.51250, 150=0.48070, 500=0.44830, 2500=0.43470, 5000=0.42760, 5=0.65170, 50=0.48720, 150=0.45700, 500=0.42620, 2500=0.41330, 5000=0.40650, 5=0.08760, 50=0.06550, 150=0.06150, 500=0.05730, 2500=0.05560, 5000=0.05470, 5=0.07600, 50=0.05680, 150=0.05330, 500=0.04970, 2500=0.04820, 5000=0.04740, 5=0.82060, 50=0.61350, 150=0.57550, 500=0.53670, 2500=0.52050, 5000=0.51190, 5=11.27820, 50=8.43200, 150=7.90970, 500=7.37670, 2500=7.15280, 5000=7.03560, 5=0.42900, 50=0.32070, 150=0.30080, 500=0.28060, 2500=0.27210, 5000=0.26760, 5=7.89070, 50=5.89940, 150=5.53390, 500=5.16100, 2500=5.00440, 5000=4.92240, 5=0.89270, 50=0.66740, 150=0.62610, 500=0.58390, 2500=0.56620, 5000=0.55690, 5=0.14100, 50=0.10540, 150=0.09890, 500=0.09220, 2500=0.08940, 5000=0.08790, 5=0.10580, 50=0.07910, 150=0.07420, 500=0.06920, 2500=0.06710, 5000=0.06600 (AUD); Series: NCP; Resistance Tolerance: 5%; RoHS Compliant: Yes; ComponentLink1URL: https://datasheet.ciiva.com/11822/0900766b807f1e39-11822526.pdf?src-supplier=RSComponents; ComponentLink1Description: https://datasheet.ciiva.com/11822/0900766b807f1e39-11822526.pdf?src-supplier=RSComponents; ComponentLink2URL: https://datasheet.ciiva.com/2848/r44e-2848532.pdf?src-supplier=Digi-Key; ComponentLink2Description: https://datasheet.ciiva.com/2848/r44e-2848532.pdf?src-supplier=Digi-Key; ComponentLink3URL: https://datasheet.ciiva.com/2848/r44e-2848534.pdf?src-supplier=Digi-Key; ComponentLink3Description: https://datasheet.ciiva.com/2848/r44e-2848534.pdf?src-supplier=Digi-Key; ComponentLink4URL: https://datasheet.ciiva.com/2848/r44e-2848533.pdf?src-supplier=Digi-Key; ComponentLink4Description: https://datasheet.ciiva.com/2848/r44e-2848533.pdf?src-supplier=Digi-Key; ComponentLink5URL: https://datasheet.ciiva.com/3282/l0770e-3282089.pdf?src-supplier=Avnet; ComponentLink5Description: https://datasheet.ciiva.com/3282/l0770e-3282089.pdf?src-supplier=Avnet; Supplier 2: Digi-Key; Supplier Part Number 2: 490-2450-1-ND; Stock 2: 55093; Pricing 2: 1=0.21000, 5=0.18800, 10=0.16700, 25=0.14960, 50=0.13140, 100=0.11210, 500=0.09266, 1000=0.07758 (USD)
R16 R17 = CMP-2001-00551-1: Manufacturer: Panasonic; Part Number: ERJ6ENF4702V; Manufacturer Part Number: ERJ-6ENF4702V; Resistance: 47kR; Tolerance: 1%; Temperature Coefficient: 100ppm/°C; Power Rating: 125mW; Voltage Rating: 150V; Supplier 1: LCSC; Supplier Part Number 1: C413309; RoHS: Yes; Category: Chip SMD Resistors; Stock 1: 45900; Pricing 1: 50=0.01790, 500=0.01400, 1500=0.01320, 5000=0.01250, 25000=0.01220, 50000=0.01190, 50=0.01760, 500=0.01380, 1500=0.01300, 5000=0.01220, 25000=0.01200, 50000=0.01170, 50=0.08940, 500=0.07000, 1500=0.06610, 5000=0.06220, 25000=0.06090, 50000=0.05960, 50=0.08500, 500=0.06650, 1500=0.06280, 5000=0.05910, 25000=0.05790, 50000=0.05670, 50=0.01140, 500=0.00890, 1500=0.00840, 5000=0.00800, 25000=0.00780, 50000=0.00760, 50=0.00990, 500=0.00780, 1500=0.00730, 5000=0.00690, 25000=0.00680, 50000=0.00660, 50=0.10700, 500=0.08380, 1500=0.07910, 5000=0.07450, 25000=0.07290, 50000=0.07140, 50=1.47110, 500=1.15130, 1500=1.08730, 5000=1.02340, 25000=1.00200, 50000=0.98070, 50=0.05600, 500=0.04380, 1500=0.04140, 5000=0.03890, 25000=0.03810, 50000=0.03730, 50=1.02920, 500=0.80550, 1500=0.76070, 5000=0.71600, 25000=0.70110, 50000=0.68610, 50=0.11640, 500=0.09110, 1500=0.08610, 5000=0.08100, 25000=0.07930, 50000=0.07760, 50=0.01840, 500=0.01440, 1500=0.01360, 5000=0.01280, 25000=0.01250, 50000=0.01230, 50=0.01380, 500=0.01080, 1500=0.01020, 5000=0.00960, 25000=0.00940, 50000=0.00920 (AUD); Mount: Surface Mount; Case/Package: 0805; Number of Pins: 2; Case Code (Metric): 2012; Case Code (Imperial): 0805; Contact Plating: Tin; Min Operating Temperature: -55°C; Max Operating Temperature: 155°C; Packaging: Tape and Reel; Resistor Type: Thick Film; Series: ERJ; Termination: SMD/SMT; Voltage Rating (DC): 150V; Number of Terminations: 2; Max Power Dissipation: 125mW; Package Quantity: 1; Features: Automotive AEC-Q200; Resistance Tolerance: 1%; Construction: Rectangular; Technology: THICK FILM; Length: 2mm; Width: 0.049inch; Height: 0.6mm; Depth: 1.25mm; Radiation Hardening: No; RoHS Compliant: Yes; Lead Free: Lead Free; Military Standard: Not; REACH SVHC: No SVHC; ComponentLink1URL: https://datasheet.ciiva.com/3883/3984280s8821682n1386-3883650.pdf?src-supplier=Arrow+Electronics; ComponentLink1Description: https://datasheet.ciiva.com/3883/3984280s8821682n1386-3883650.pdf?src-supplier=Arrow+Electronics; ComponentLink2URL: https://datasheet.ciiva.com/11821/0900766b80f80784-11821639.pdf?src-supplier=RSComponents; ComponentLink2Description: https://datasheet.ciiva.com/11821/0900766b80f80784-11821639.pdf?src-supplier=RSComponents; ComponentLink3URL: https://datasheet.ciiva.com/9189/aoa0000ce2-9189448.pdf?src-supplier=Avnet; ComponentLink3Description: https://datasheet.ciiva.com/9189/aoa0000ce2-9189448.pdf?src-supplier=Avnet; ComponentLink4URL: https://datasheet.ciiva.com/17209/aoa0000ce2-17209704.pdf?src-supplier=Avnet+Europe; ComponentLink4Description: https://datasheet.ciiva.com/17209/aoa0000ce2-17209704.pdf?src-supplier=Avnet+Europe; ComponentLink5URL: https://datasheet.ciiva.com/16765/70260748-16765017.pdf?src-supplier=Allied+Electronics; ComponentLink5Description: https://datasheet.ciiva.com/16765/70260748-16765017.pdf?src-supplier=Allied+Electronics; ComponentLink6URL: https://datasheet.ciiva.com/30059/aoa0000ce2-30059497.pdf?src-supplier=Onlinecomponents.com; ComponentLink6Description: https://datasheet.ciiva.com/30059/aoa0000ce2-30059497.pdf?src-supplier=Onlinecomponents.com; ComponentLink7URL: https://datasheet.ciiva.com/7802/426256-7802693.pdf?src-supplier=Element14; ComponentLink7Description: https://datasheet.ciiva.com/7802/426256-7802693.pdf?src-supplier=Element14; ComponentLink8URL: https://datasheet.ciiva.com/28587/1678782-28587221.pdf?src-supplier=Element14; ComponentLink8Description: https://datasheet.ciiva.com/28587/1678782-28587221.pdf?src-supplier=Element14; ComponentLink9URL: https://datasheet.ciiva.com/16511/aoa0000ce2-16511980.pdf?src-supplier=Avnet+Asia; ComponentLink9Description: https://datasheet.ciiva.com/16511/aoa0000ce2-16511980.pdf?src-supplier=Avnet+Asia; Supplier 2: Digi-Key; Supplier Part Number 2: P47.0KCCT-ND; Stock 2: 6680; Pricing 2: 1=0.10000, 10=0.07200, 100=0.02750, 1000=0.01210, 2500=0.01045 (USD)
U3 = CMP-2000-04923-1: High speed CAN transceiver, 4.75 to 5.25 V, -40 to 150 degC, 8-Pin SO (SOT96-1), RoHS, Tape and Reel; Manufacturer: NXP Semiconductors; Duplex: Half; Number of Drivers/Receivers: 1/1; Product Training Modules: CANandLINBusTransceiver; Receiver Hysteresis: 70mV; Voltage - Supply: 4.75V~5.25V; Dynamic Catalog: CANTransceivers; Other Names: 568-10292-1; PCN Packaging: LighterPackingReels30/Mar/2014; PCN Obsolescence: TJA105028/Apr/2013 / MultipleDevices19/Apr/2013; Max Supply Voltage: 5.25V; Min Supply Voltage: 4.75V; Number of Transceivers: 1; Max Supply Current: 10mA; Data Rate: 1Mbps; Simplex/Duplex: Half Duplex; Standard Package: 1; Family: Interface-Drivers,Receivers,Transceivers; Package Reference: SOT96-1; Mounting Type: SurfaceMount; Package / Case: 8-SOIC(0.154",3.90mmWidth); Package Description: 8-Pin Small Outline Integrated Circuit, Body 4.9 x 3.9 mm, Pitch 1.27 mm; Protocol: CAN; Package/Case: 8-SOIC(0.154",3.90mmWidth); Supplier Device Package: 8-SO; <PCN>: http://media.digikey.com/pdf/PCNs/NXP/201209019F04_TJA1050_Obs.pdf; Minimum Quantity: Transceiver; Datasheet URL: http://www.nxp.com/documents/data_sheet/TJA1050.pdf; Category: IntegratedCircuits(ICs); Quantity Available: CutTape(CT)AlternatePackaging; Datasheet Version: Rev. 4, 10/2003; Type: Transceiver; Packaging: CutTape(CT); Manufacturer URL: http://www.nxp.com/; Supplier 1: LCSC; Supplier Part Number 1: C6952; Manufacturer Part Number: TJA1050T/CM,118; RoHS: Yes; Stock 1: 6230; Pricing 1: 1=0.78820, 10=0.57770, 30=0.54030, 100=0.50050, 500=0.47480, 1000=0.47250, 1=0.75220, 10=0.55130, 30=0.51560, 100=0.47770, 500=0.45310, 1000=0.45090, 1=3.93160, 10=2.88160, 30=2.69500, 100=2.49660, 500=2.36830, 1000=2.35660, 1=3.57520, 10=2.62040, 30=2.45070, 100=2.27030, 500=2.15360, 1000=2.14300, 1=0.48040, 10=0.35210, 30=0.32930, 100=0.30500, 500=0.28940, 1000=0.28790, 1=0.43780, 10=0.32090, 30=0.30010, 100=0.27800, 500=0.26370, 1000=0.26240, 1=4.35370, 10=3.19100, 30=2.98430, 100=2.76470, 500=2.62260, 1000=2.60970, 1=59.36650, 10=43.51200, 30=40.69330, 100=37.69860, 500=35.76080, 1000=35.58470, 1=2.39020, 10=1.75180, 30=1.63840, 100=1.51780, 500=1.43980, 1000=1.43270, 1=40.25070, 10=29.50130, 30=27.59030, 100=25.55980, 500=24.24600, 1000=24.12660, 1=4.94380, 10=3.62350, 30=3.38880, 100=3.13940, 500=2.97800, 1000=2.96340, 1=0.77540, 10=0.56830, 30=0.53150, 100=0.49240, 500=0.46710, 1000=0.46480, 1=0.56167, 10=0.41167, 30=0.38500, 100=0.35667, 500=0.33833, 1000=0.33667 (AUD); Mount: Surface Mount; Case/Package: SO; Number of Pins: 8; Contact Plating: Gold,Silver; Min Operating Temperature: -40°C; Max Operating Temperature: 150°C; Package Quantity: 2500; Nominal Supply Current: 10mA; Interface: CAN; Number of Transmit Buffers: 1; Number of Receive Buffers: 1; Radiation Hardening: No; Lead Free: Lead Free; REACH SVHC: No SVHC; ComponentLink1URL: https://datasheet.ciiva.com/18624/tja1050-18624869.pdf?src-supplier=Digi-Key; ComponentLink1Description: https://datasheet.ciiva.com/18624/tja1050-18624869.pdf?src-supplier=Digi-Key; ComponentLink2URL: https://datasheet.ciiva.com/26933/getdatasheetpartid-747091-26933446.pdf?src-supplier=Verical; ComponentLink2Description: https://datasheet.ciiva.com/26933/getdatasheetpartid-747091-26933446.pdf?src-supplier=Verical; ComponentLink3URL: https://datasheet.ciiva.com/29891/tja1050-29891527.pdf?src-supplier=Avnet; ComponentLink3Description: https://datasheet.ciiva.com/29891/tja1050-29891527.pdf?src-supplier=Avnet; ComponentLink4URL: https://datasheet.ciiva.com/24191/tja1050-24191228.pdf?src-supplier=Future+Electronics; ComponentLink4Description: https://datasheet.ciiva.com/24191/tja1050-24191228.pdf?src-supplier=Future+Electronics; Supplier 2: Digi-Key; Supplier Part Number 2: 568-10292-1-ND; Stock 2: 109237; Pricing 2: 1=1.22000, 10=1.09200, 25=1.03600, 100=0.79550, 250=0.70300, 500=0.66600, 1000=0.51800 (USD)